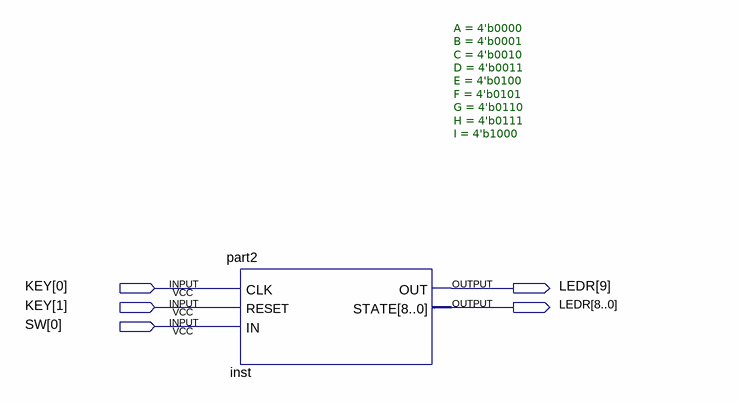
[diagram p0: schematic sheet]
// Quartus schematic Block2.bdf as structural Verilog: 1 symbols, 5 pins
module Block2 (
  input  [1:0] KEY,
  input  [0:0] SW,
  output [9:0] LEDR
);

  part2 #(.A(4'b0000), .B(4'b0001), .C(4'b0010), .D(4'b0011), .E(4'b0100), .F(4'b0101), .G(4'b0110), .H(4'b0111), .I(4'b1000)) inst (
    .CLK(KEY[0]), .RESET(KEY[1]), .IN(SW[0]), .OUT(LEDR[9]), .STATE(LEDR[8:0]));
endmodule
